# EAGLE design kawaiino_v1 (EAGLE 9.5.0)
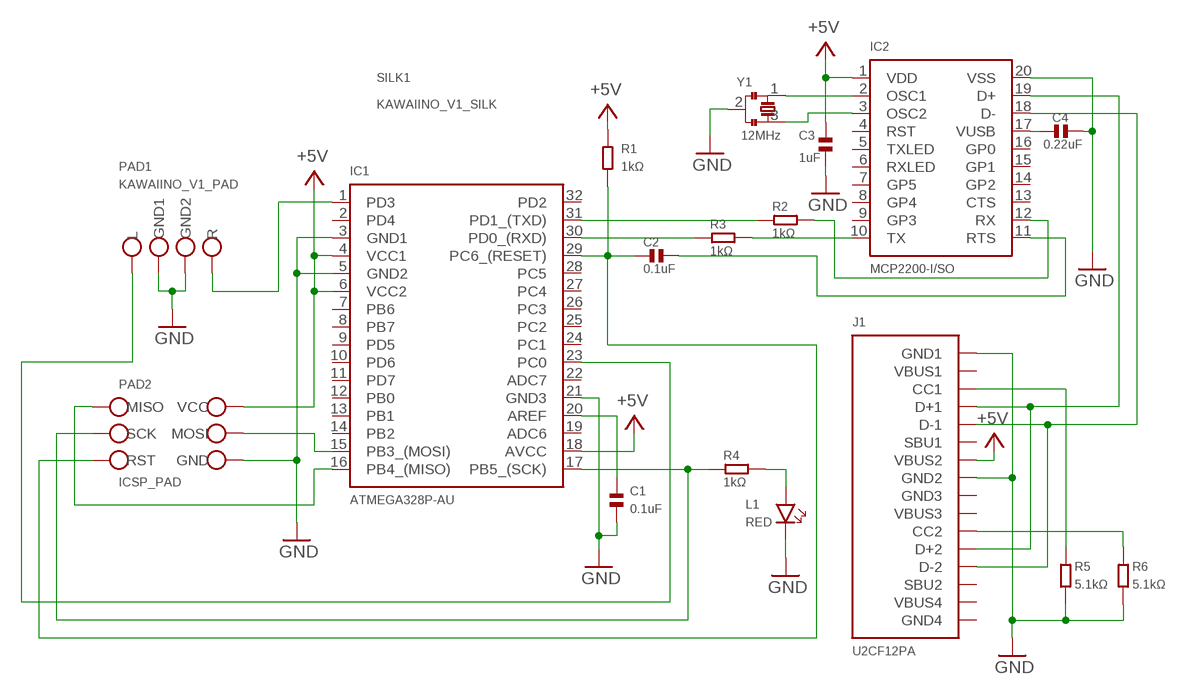
[diagram p0: schematic, sheet 1]

## Parts
C1  0.1uF  CAPACITOR-1608  [1608_FOOTPRINT]
C2  0.1uF  CAPACITOR-1608  [1608_FOOTPRINT]
C3  1uF  CAPACITOR-1608  [1608_FOOTPRINT]
C4  0.22uF  CAPACITOR-1608  [1608_FOOTPRINT]
IC1  ATMEGA328P-AU  [TQFP-32]
IC2  MCP2200-I/SO  [SOIC20]
J1  U2CF12PA  [U2CF12PA_FOOTPRINT]
L1  RED  LED-1608  [1608_FOOTPRINT]
PAD1  KAWAIINO_V1_PAD  [KAWAIINO_V1_PAD]
PAD2  ICSP_PAD  [ICSP_PAD]
R1  1kΩ  REGISTER-2012  [2012_FOOTPRINT]
R2  1kΩ  REGISTER-2012  [2012_FOOTPRINT]
R3  1kΩ  REGISTER-2012  [2012_FOOTPRINT]
R4  1kΩ  REGISTER-2012  [2012_FOOTPRINT]
R5  5.1kΩ  REGISTER-2012  [2012_FOOTPRINT]
R6  5.1kΩ  REGISTER-2012  [2012_FOOTPRINT]
SILK1  KAWAIINO_V1_SILK  [KAWAIINO_V1_SILK]
Y1  12MHz  CSTNE_G  [CSTNE_G_FOOTPRINT]

## Nets
+5V: C3.1 IC1.4(VCC1) IC1.6(VCC2) IC1.18(AVCC) IC2.1(VDD) J1.7(VBUS2) PAD2.2(VCC) R1.1
GND: C1.2 C3.2 C4.2 IC1.3(GND1) IC1.5(GND2) IC1.21(GND3) IC2.20(VSS) J1.1(GND1) J1.8(GND2) L1.2(-) PAD1.P$2(GND1) PAD1.P$3(GND2) PAD2.6(GND) R5.2 R6.2 Y1.2
N$1: IC1.30(PD0_(RXD)) R3.1
N$2: IC1.31(PD1_(TXD)) R2.1
N$3: IC2.10(TX) R3.2
N$4: IC2.12(RX) R2.2
N$5: C1.1 IC1.20(AREF)
N$6: C2.1 IC1.29(PC6_(RESET)) PAD2.5(RST) R1.2
N$7: C4.1 IC2.17(VUSB)
N$8: IC2.2(OSC1) Y1.1
N$9: IC2.3(OSC2) Y1.3
N$11: IC1.1(PD3) PAD1.P$4(R)
N$12: IC1.23(PC0) PAD1.P$1(L)
N$13: IC1.15(PB3_(MOSI)) PAD2.4(MOSI)
N$14: IC1.16(PB4_(MISO)) PAD2.1(MISO)
N$15: IC1.17(PB5_(SCK)) PAD2.3(SCK) R4.1
N$16: L1.1(+) R4.2
N$18: J1.11(CC2) R6.1
N$19: IC2.19(D+) J1.4(D+1) J1.12(D+2)
N$20: IC2.18(D-) J1.5(D-1) J1.13(D-2)
N$21: J1.3(CC1) R5.1
N$22: C2.2 IC2.11(RTS)
Unconnected: IC1.2(PD4) IC1.7(PB6) IC1.8(PB7) IC1.9(PD5) IC1.10(PD6) IC1.11(PD7) IC1.12(PB0) IC1.13(PB1) IC1.14(PB2) IC1.19(ADC6) IC1.22(ADC7) IC1.24(PC1) IC1.25(PC2) IC1.26(PC3) IC1.27(PC4) IC1.28(PC5) IC1.32(PD2) IC2.4(RST) IC2.5(TXLED) IC2.6(RXLED) IC2.7(GP5) IC2.8(GP4) IC2.9(GP3) IC2.13(CTS) IC2.14(GP2) IC2.15(GP1) IC2.16(GP0) J1.2(VBUS1) J1.6(SBU1) J1.9(GND3) J1.10(VBUS3) J1.14(SBU2) J1.15(VBUS4) J1.16(GND4)

## Library data of the parts
C1-C4 = Parts-yosuke25:CAPACITOR-1608
IC1 = Parts-yosuke25:ATMEGA328P-AU
IC2 = Parts-yosuke25:MCP2200-I/SO
J1 = Parts-yosuke25:U2CF12PA
L1 = Parts-yosuke25:LED-1608
PAD1 = Parts-yosuke25:KAWAIINO_V1_PAD
PAD2 = Parts-yosuke25:ICSP_PAD
R1-R6 = Parts-yosuke25:REGISTER-2012
SILK1 = Parts-yosuke25:KAWAIINO_V1_SILK
Y1 = Parts-yosuke25:CSTNE_G

## Board
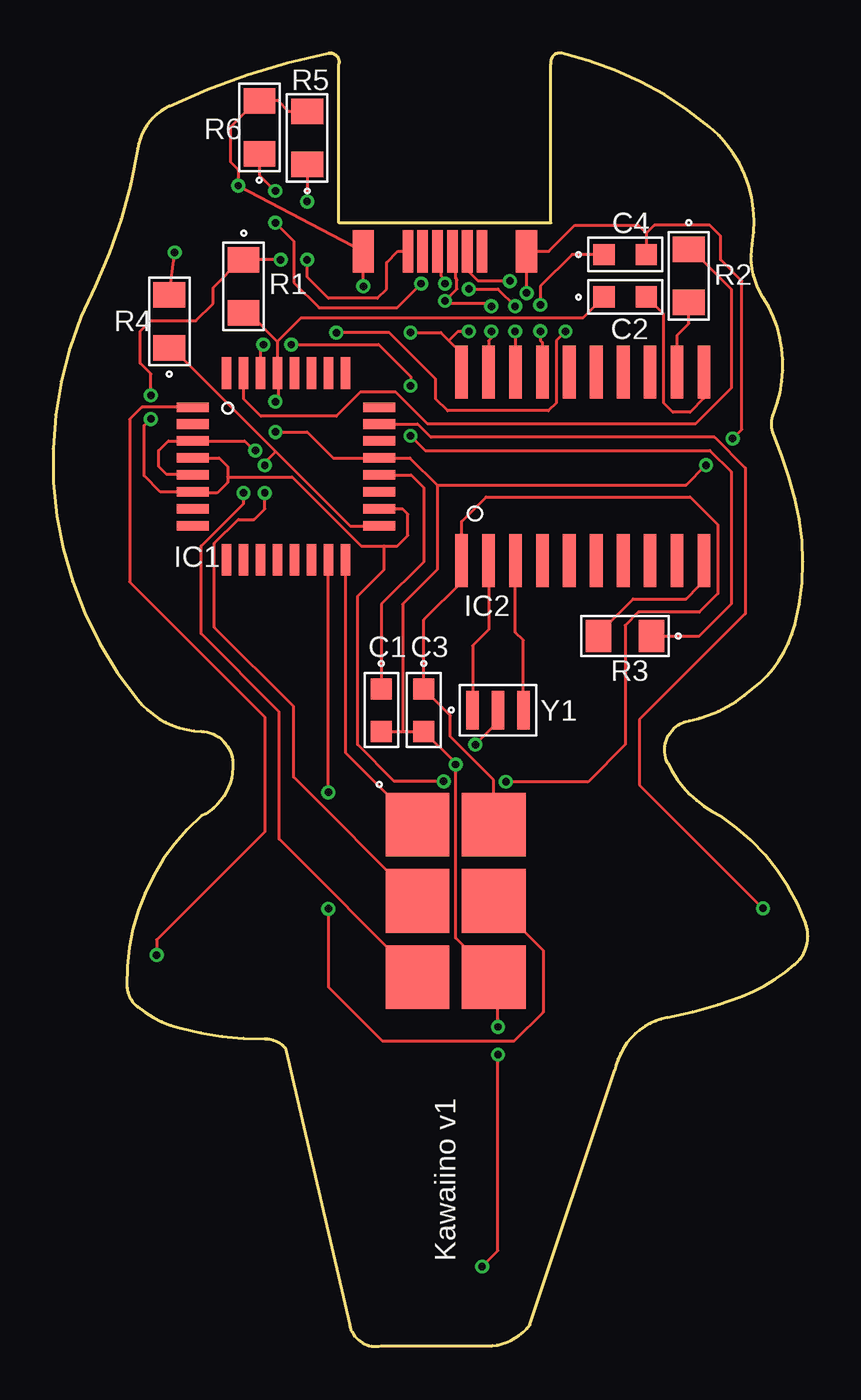
[diagram p1: board, top side]
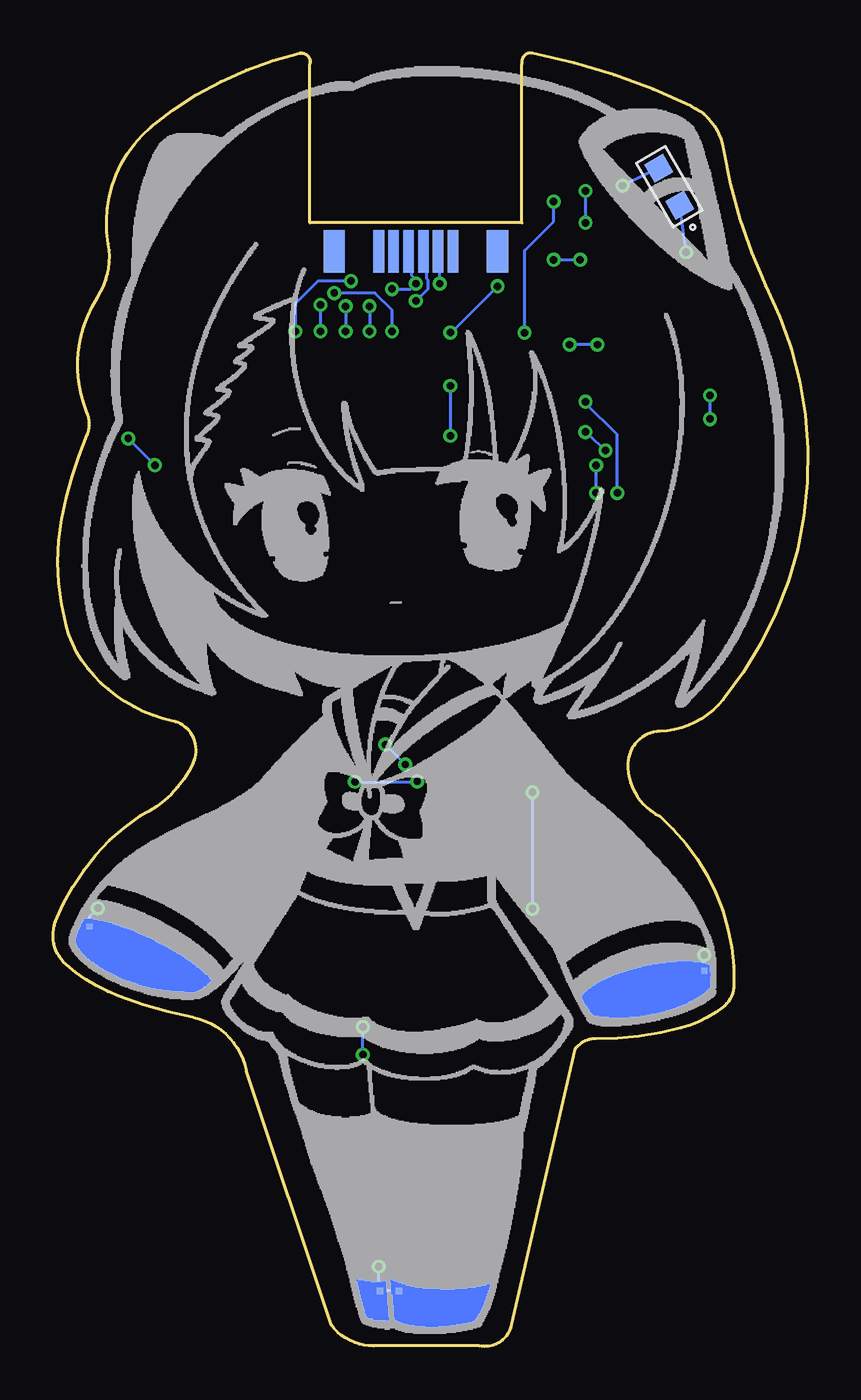
[diagram p2: board, bottom side, seen from below]

Size 35.6 x 61.04 mm. Coordinates in mm from the lower left corner, seen from the top.
Outline: 15.49,0.02 20.49,0.02 arc53 22.49,1.02 26.49,13.02 arc-68 28.99,15.52 arc9 32.49,16.52 arc21 34.99,18.02 arc69 35.49,20.02 arc36 31.49,25.02 arc-39 28.99,27.52 arc-104 29.99,29.52 arc30 32.99,31.02 arc38 34.99,34.02 arc29 34.99,40.02 arc8 33.99,43.02 arc-44 33.99,44.02 arc55 33.49,49.52 arc-43 32.99,52.02 arc60 30.99,57.52 arc27 23.99,61.02 arc116 23.49,60.52 23.49,53.02 13.49,53.02 13.49,60.52 arc113 12.99,61.02 arc14 5.49,58.52 arc55 3.99,56.52 arc-16 1.99,50.02 arc66 3.99,30.52 arc49 6.99,29.02 arc-86 8.49,27.52 arc-66 6.99,25.02 arc50 3.49,17.02 arc50 3.99,16.02 arc24 5.99,15.02 arc15 9.99,14.52 arc-54 10.99,14.02 13.99,1.02 arc90 15.49,0.02
Copper layers (1*16): Top 0.035mm / dielectric 1.5mm / Bottom 0.035mm
Design rules "SeeedStudio_2layer_DRU_no_angle_20140221": minimum track width 6mil, minimum drill 12mil, track to track 6mil, track to pad 6mil, pad to pad 6mil, via to via 6mil, smd to smd 0mil, copper to edge 10mil, drill to drill 10mil, minimum pad ring 10mil, minimum via ring 6mil, stop-mask expansion 2mil, vias tented up to drill 100mil, thermal gap 10mil

### Footprints (pad centres in the part's own frame; a part is rotated, then mirrored left to right if it is on the bottom)
1608_FOOTPRINT = smd 1 x 1: 1 -1,0; 2 1,0
TQFP-32 = smd 1.5 x 0.45: 1 -4.4,2.8; 2 -4.4,2; 3 -4.4,1.2; 4 -4.4,0.4; 5 -4.4,-0.4; 6 -4.4,-1.2; 7 -4.4,-2; 8 -4.4,-2.8; 17 4.4,-2.8; 18 4.4,-2; 19 4.4,-1.2; 20 4.4,-0.4; 21 4.4,0.4; 22 4.4,1.2; 23 4.4,2; 24 4.4,2.8 | smd 0.45 x 1.5: 9 -2.8,-4.4; 10 -2,-4.4; 11 -1.2,-4.4; 12 -0.4,-4.4; 13 0.4,-4.4; 14 1.2,-4.4; 15 2,-4.4; 16 2.8,-4.4; 25 2.8,4.4; 26 2,4.4; 27 1.2,4.4; 28 0.4,4.4; 29 -0.4,4.4; 30 -1.2,4.4; 31 -2,4.4; 32 -2.8,4.4
SOIC20 = smd 0.6 x 2.5: 1 -5.715,-4.445; 2 -4.445,-4.445; 3 -3.175,-4.445; 4 -1.905,-4.445; 5 -0.635,-4.445; 6 0.635,-4.445; 7 1.905,-4.445; 8 3.175,-4.445; 9 4.445,-4.445; 10 5.715,-4.445; 11 5.715,4.445; 12 4.445,4.445; 13 3.175,4.445; 14 1.905,4.445; 15 0.635,4.445; 16 -0.635,4.445; 17 -1.905,4.445; 18 -3.175,4.445; 19 -4.445,4.445; 20 -5.715,4.445
U2CF12PA_FOOTPRINT = smd 1 x 2: 1 -3.85,0; 8 3.85,0 | smd 0.5 x 2: 2 -1.75,0; 3 -1.05,0; 4 -0.35,0; 5 0.35,0; 6 1.05,0; 7 1.75,0 | smd 1 x 2 bottom: 9 3.85,0; 16 -3.85,0 | smd 0.5 x 2 bottom: 10 1.75,0; 11 1.05,0; 12 0.35,0; 13 -0.35,0; 14 -1.05,0; 15 -1.75,0
KAWAIINO_V1_PAD = smd 0.3 x 0.3: P$1 1.1,19.3; P$2 14.8,2.1; P$3 15.7,2.1; P$4 30.1,17.2
ICSP_PAD = smd 3 x 3: 1 -1.8,3.6; 2 1.8,3.6; 3 -1.8,0; 4 1.8,0; 5 -1.8,-3.6; 6 1.8,-3.6
2012_FOOTPRINT = smd 1.2 x 1.5: 1 -1.25,0; 2 1.25,0
CSTNE_G_FOOTPRINT = smd 0.6 x 1.8: 1 -1.2,0; 2 0,0; 3 1.2,0

### Placement (x,y rotation side)
C1  15.49,30.02 270 top
C2  26.99,49.52 0 top
C3  17.49,30.02 270 top
C4  26.99,51.52 0 top
IC1  10.99,41.52 0 top
IC2  24.99,41.52 0 top
J1  18.49,51.67 180 top
L1  6.54,54.72 120 bottom
PAD1  34.99,0.52 0 bottom
PAD2  18.99,21.02 0 top
R1  8.99,50.02 270 top
R2  29.99,50.52 270 top
R3  26.99,33.52 180 top
R4  5.49,48.37 90 top
R5  11.99,57.02 90 top
R6  9.74,57.52 90 top
SILK1  34.99,0.52 0 bottom
Y1  20.99,30.02 0 top

### Tracks (layer width: path | path; a pad name or v marks a point on that pad's centre or on a via)
+5V  (via drill 0.35)
  Top 0.152: IC1.4 7.84,41.92 8.24,41.52 8.24,41.02 | 8.24,41.02 8.24,40.77 7.74,40.27 6.64,40.27 IC1.6 5.06,40.32 4.3,41.09 4.3,43.46 v4.61,43.77 | 8.24,41.02 11.28,41.02 14.53,37.77 15.61,37.77 | 15.61,37.77 16.24,37.77 16.74,38.27 16.74,39.27 16.49,39.52 IC1.18 | PAD2.2 20.79,26.72 18.74,28.77 18.74,29.77 C3.1 17.49,34.29 19.27,36.08 IC2.1 19.27,38.93 20.43,40.09 30.05,40.09 31.36,38.77 31.36,35.52 30.49,34.65 27.61,34.65 26.99,34.02 26.99,28.4 25.24,26.65 v21.36,26.65 | v18.43,26.67 16.1,26.67 14.36,28.4 14.36,35.4 15.61,36.65 15.61,37.77 | v4.61,44.88 4.61,45.9 4.11,46.4 4.11,47.9 4.61,48.4 6.74,48.4 7.55,49.21 7.55,49.96 8.86,51.27 R1.1 v10.74,51.27 | v11.99,51.27 11.99,50.46 12.99,49.46 15.3,49.46 15.74,49.9 15.74,51.15 16.26,51.67 J1.7
  Bottom 0.152: v21.36,26.65 18.41,26.65 v18.43,26.67 | v4.61,43.77 v4.61,44.88 | v11.99,51.27 v10.74,51.27
GND  (via drill 0.35)
  Top 0.152: 27.99,52.52 27.61,52.9 24.61,52.9 23.39,51.67 J1.1 v22.34,49.71 | 27.99,52.52 C4.2 | v20.24,3.77 20.99,4.52 v20.99,13.77 | v20.99,15.08 20.99,17.22 PAD2.6 20.79,17.47 18.99,19.27 v18.99,27.46 18.99,27.52 C3.2 16.49,29.02 | C1.2 16.49,29.02 | v19.93,28.4 20.99,29.46 Y1.2 | IC1.5 6.56,41.15 5.36,41.15 4.99,41.52 4.99,42.27 5.44,42.72 IC1.3 9.04,42.72 9.49,42.27 9.54,42.27 v9.54,42.28 | v10.49,43.16 11.98,43.16 13.21,41.92 IC1.21 16.84,41.92 18.11,40.65 | 18.11,40.65 18.11,36.65 16.49,35.02 16.49,29.02 | v16.86,47.84 18.29,47.84 18.68,47.46 | IC2.20 19.27,46.86 18.68,47.46 | 18.11,40.65 29.86,40.65 v30.8,41.59 | v32.06,42.84 32.49,43.27 32.49,50.27 31.49,51.27 31.49,52.4 30.99,52.9 28.36,52.9 27.99,52.52 | R5.2 11.11,58.27 10.61,58.77 R6.2 9.61,58.77 8.36,57.52 8.36,55.9 8.74,55.52 v8.74,54.77 J1.8 v14.64,50.02 | 18.68,47.46 19.11,47.9 v19.61,47.9
  Bottom 0.152: L1.2 v8.74,54.77 | PAD1.P$3 PAD1.P$2 20.24,2.67 v20.24,3.77 | v19.93,28.4 v18.99,27.46 | v9.54,42.28 10.36,43.02 v10.49,43.16 | v14.64,50.02 16.82,47.84 v16.86,47.84 | v19.61,47.9 19.61,48.9 20.43,49.71 v22.34,49.71 | v30.8,41.59 v32.06,42.84 | v20.99,13.77 v20.99,15.08
N$1  (via drill 0.35)
  Top 0.152: R3.1 30.49,33.52 31.99,35.02 31.99,41.27 30.98,42.28 17.55,42.28 v16.86,42.97 | IC1.30 9.79,47.14 v9.93,47.27 | v11.24,47.27 15.36,47.27 16.86,45.77 v16.86,45.33
  Bottom 0.152: v9.93,47.27 v11.24,47.27 | v16.86,45.33 v16.86,42.97
N$2
  Top 0.152: R2.1 30.11,51.77 31.99,49.9 31.99,45.21 30.3,43.52 17.68,43.52 16.18,45.02 14.49,45.02 13.36,43.9 9.8,43.9 8.99,44.71 IC1.31
N$3
  Top 0.152: R3.2 25.74,33.65 27.36,35.27 29.86,35.27 30.49,35.9 30.49,36.86 IC2.10
N$4
  Top 0.152: IC2.12 29.43,47.72 29.99,48.27 R2.2
N$5
  Top 0.152: IC1.20 16.89,41.12 17.49,40.52 17.49,37.02 15.49,35.02 C1.1
N$6  (via drill 0.35)
  Top 0.152: C2.1 24.99,48.52 11.69,48.52 10.59,47.42 IC1.29 | R1.2 9.24,48.77 10.59,47.42 IC1.29 | PAD2.5 10.67,23.94 10.67,29.95 6.99,33.63 6.99,37.77 8.99,39.77 v8.99,40.27 | IC1.29 10.61,45.9 10.61,44.71 v10.49,44.58
  Bottom 0.152: v8.99,40.27 8.99,43.02 10.49,44.52 v10.49,44.58
N$7  (via drill 0.35)
  Top 0.152: C4.1 24.49,51.52 22.99,50.02 v22.99,49.15 | v22.99,47.91 22.99,47.47 23.08,47.37 IC2.17
  Bottom 0.152: v22.99,49.15 v22.99,47.91
N$8
  Top 0.152: IC2.2 20.54,33.83 19.79,33.07 Y1.1
N$9
  Top 0.152: Y1.3 22.19,33.32 21.81,33.7 IC2.3
N$11  (via drill 0.35)
  Top 0.152: IC1.1 4.19,44.32 3.61,43.75 3.61,36.07 9.99,29.7 9.99,24.29 4.89,19.19 v4.89,18.47
  Bottom 0.152: v4.89,18.47 PAD1.P$4
N$12  (via drill 0.35)
  Top 0.152: IC1.23 17.2,43.52 17.82,42.9 31.21,42.9 32.66,41.45 32.66,34.57 27.66,29.57 27.66,26.5 v33.49,20.67
  Bottom 0.152: v33.49,20.67 33.89,20.27 PAD1.P$1
N$13  (via drill 0.35)
  Top 0.152: PAD2.4 23.11,18.7 23.11,15.77 21.74,14.4 15.55,14.4 12.99,16.96 v12.99,20.65 | v12.99,26.15 IC1.15
  Bottom 0.152: v12.99,26.15 v12.99,20.65
N$14
  Top 0.152: IC1.16 13.79,28.02 PAD2.1
N$15  (via drill 0.35)
  Top 0.152: R4.1 5.61,47.12 10.48,42.26 | 10.48,42.26 14.01,38.72 IC1.17 | PAD2.3 11.35,26.86 11.35,30.2 7.61,33.94 7.61,37.9 8.74,39.02 9.49,39.02 9.99,39.52 v9.99,40.27 | v9.99,41.58 9.99,41.71 10.48,42.19 10.48,42.26
  Bottom 0.152: v9.99,40.27 v9.99,41.58
N$16  (via drill 0.35)
  Top 0.152: R4.2 v5.74,51.62
  Bottom 0.152: v5.74,51.62 L1.1
N$18  (via drill 0.35)
  Top 0.152: R6.1 9.74,55.27 v10.49,54.52 | v10.49,53.02 11.36,52.15 11.36,50.2 12.55,49.02 16.23,49.02 v17.36,50.15
  Bottom 0.152: v10.49,54.52 v10.49,53.02 | J1.11 17.36,51.6 v17.36,50.15
N$19  (via drill 0.35)
  Top 0.152: IC2.19 20.61,46.04 20.55,46.1 20.55,47.46 20.68,47.59 v20.68,47.9 | J1.4 18.99,51.52 18.99,50.4 19.05,50.34 19.05,49.9 18.68,49.52 18.49,49.52 v18.49,49.34 18.61,49.21 20.55,49.21 v20.68,49.09
  Bottom 0.152: J1.12 18.14,50.92 17.99,50.77 17.99,50.4 17.93,50.34 17.93,49.9 18.3,49.52 18.49,49.52 v18.49,49.34 | v20.68,49.09 v20.68,47.9
N$20  (via drill 0.35)
  Top 0.152: IC2.18 21.86,46.02 21.8,46.08 v21.8,47.9 | J1.5 18.3,51.51 18.3,50.52 18.49,50.34 v18.49,50.15 | v19.61,49.9 20.99,49.9 v21.8,49.09
  Bottom 0.152: J1.13 18.68,51.51 18.68,50.52 18.49,50.34 v18.49,50.15 18.74,49.9 v19.61,49.9 | v21.8,49.09 v21.8,47.9
N$21  (via drill 0.35)
  Top 0.152: R5.1 v11.99,54.02 | J1.3 19.68,51.54 19.68,50.65 20.05,50.27 v21.55,50.27 | v24.18,47.9 23.74,47.46 23.74,44.52 23.36,44.15 18.61,44.15 18.05,44.71 18.05,45.65 15.86,47.84 v13.36,47.84
  Bottom 0.152: v21.55,50.27 23.11,50.27 24.18,49.21 v24.18,47.9 | v13.36,47.84 13.36,51.71 11.99,53.09 v11.99,54.02
N$22
  Top 0.152: IC2.11 30.7,44.74 30.05,44.09 29.24,44.09 28.8,44.52 28.8,48.71 C2.2

### Text on the board
tPlace: R5 | R6 | C4 | R2 | R1 | R4 | C2 | IC1 | IC2 | C1 | C3 | R3 | Y1 | Kawaiino v1